# EAGLE design LM (EAGLE 9.6.2)
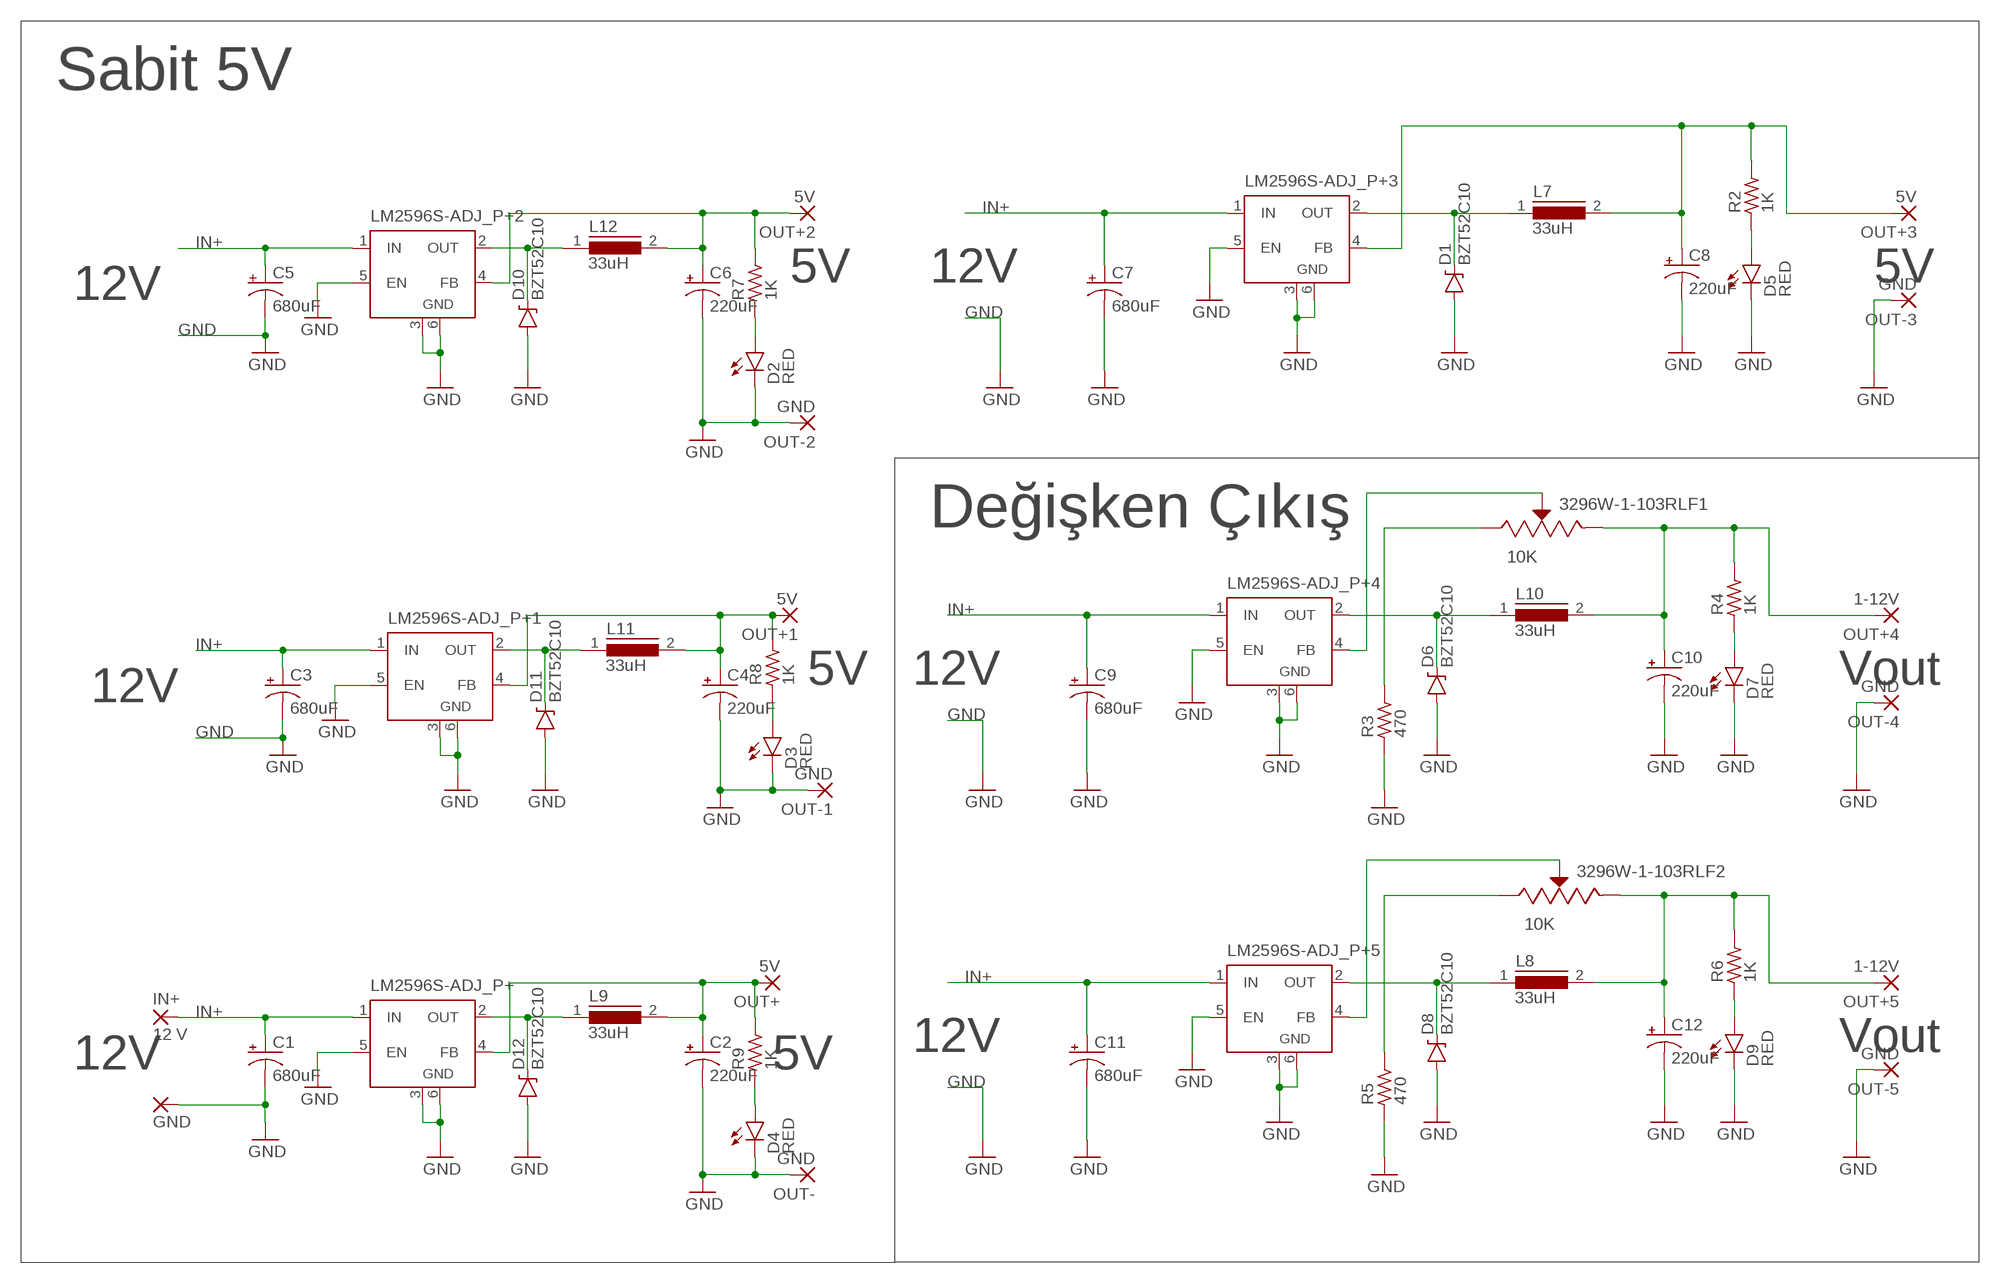
[diagram p0: schematic, sheet 1]

## Parts
3296W-1-103RLF1  10K  3296W-1-103RLF  [TRIM_3296W-1-103RLF]
3296W-1-103RLF2  10K  3296W-1-103RLF  [TRIM_3296W-1-103RLF]
C1  680uF  CAP_POLG  [PANASONIC_G]
C2  220uF  CAP_POLG  [PANASONIC_G]
C3  680uF  CAP_POLG  [PANASONIC_G]
C4  220uF  CAP_POLG  [PANASONIC_G]
C5  680uF  CAP_POLG  [PANASONIC_G]
C6  220uF  CAP_POLG  [PANASONIC_G]
C7  680uF  CAP_POLG  [PANASONIC_G]
C8  220uF  CAP_POLG  [PANASONIC_G]
C9  680uF  CAP_POLG  [PANASONIC_G]
C10  220uF  CAP_POLG  [PANASONIC_G]
C11  680uF  CAP_POLG  [PANASONIC_G]
C12  220uF  CAP_POLG  [PANASONIC_G]
D1  BZT52C10  [SOD-123_2]
D2  RED  LED-RED1206  [LED-1206]
D3  RED  LED-RED1206  [LED-1206]
D4  RED  LED-RED1206  [LED-1206]
D5  RED  LED-RED1206  [LED-1206]
D6  BZT52C10  [SOD-123_2]
D7  RED  LED-RED1206  [LED-1206]
D8  BZT52C10  [SOD-123_2]
D9  RED  LED-RED1206  [LED-1206]
D10  BZT52C10  [SOD-123_2]
D11  BZT52C10  [SOD-123_2]
D12  BZT52C10  [SOD-123_2]
IN+  12 V  SMD5  [SMD2,54-5,08]
IN-  GND  3,81/1,1  [3,81/1,1]
L7  33uH  DR127  [DR127]
L8  33uH  DR127  [DR127]
L9  33uH  DR127  [DR127]
L10  33uH  DR127  [DR127]
L11  33uH  DR127  [DR127]
L12  33uH  DR127  [DR127]
LM2596S-ADJ_P+  LM2596S  [TO263-5]
LM2596S-ADJ_P+1  LM2596S  [TO263-5]
LM2596S-ADJ_P+2  LM2596S  [TO263-5]
LM2596S-ADJ_P+3  LM2596S  [TO263-5]
LM2596S-ADJ_P+4  LM2596S  [TO263-5]
LM2596S-ADJ_P+5  LM2596S  [TO263-5]
OUT+  5V  SMD5  [SMD2,54-5,08]
OUT+1  5V  SMD5  [SMD2,54-5,08]
OUT+2  5V  SMD5  [SMD2,54-5,08]
OUT+3  5V  SMD5  [SMD2,54-5,08]
OUT+4  1-12V  SMD5  [SMD2,54-5,08]
OUT+5  1-12V  SMD5  [SMD2,54-5,08]
OUT-  GND  3,81/1,1  [3,81/1,1]
OUT-1  GND  3,81/1,1  [3,81/1,1]
OUT-2  GND  3,81/1,1  [3,81/1,1]
OUT-3  GND  3,81/1,1  [3,81/1,1]
OUT-4  GND  3,81/1,1  [3,81/1,1]
OUT-5  GND  3,81/1,1  [3,81/1,1]
R2  1K  R_0805  [R0805]
R3  470  R_1206  [R1206]
R4  1K  R_0805  [R0805]
R5  470  R_1206  [R1206]
R6  1K  R_0805  [R0805]
R7  1K  R_0805  [R0805]
R8  1K  R_0805  [R0805]
R9  1K  R_0805  [R0805]

## Nets
GND: C1.- C2.- C3.- C4.- C5.- C6.- C7.- C8.- C9.- C10.- C11.- C12.- D1.A D2.C D3.C D4.C D5.C D6.A D7.C D8.A D9.C D10.A D11.A D12.A IN-.1(P) LM2596S-ADJ_P+1.3(GND) LM2596S-ADJ_P+1.5(EN) LM2596S-ADJ_P+1.6(GND) LM2596S-ADJ_P+2.3(GND) LM2596S-ADJ_P+2.5(EN) LM2596S-ADJ_P+2.6(GND) LM2596S-ADJ_P+3.3(GND) LM2596S-ADJ_P+3.5(EN) LM2596S-ADJ_P+3.6(GND) LM2596S-ADJ_P+4.3(GND) LM2596S-ADJ_P+4.5(EN) LM2596S-ADJ_P+4.6(GND) LM2596S-ADJ_P+5.3(GND) LM2596S-ADJ_P+5.5(EN) LM2596S-ADJ_P+5.6(GND) LM2596S-ADJ_P+.3(GND) LM2596S-ADJ_P+.5(EN) LM2596S-ADJ_P+.6(GND) OUT-1.1(P) OUT-2.1(P) OUT-3.1(P) OUT-4.1(P) OUT-5.1(P) OUT-.1(P) R3.1 R5.1
IN+: C1.+ C3.+ C5.+ C7.+ C9.+ C11.+ IN+.1(P) LM2596S-ADJ_P+1.1(IN) LM2596S-ADJ_P+2.1(IN) LM2596S-ADJ_P+3.1(IN) LM2596S-ADJ_P+4.1(IN) LM2596S-ADJ_P+5.1(IN) LM2596S-ADJ_P+.1(IN)
N$1: D4.A R9.1
N$2: D12.C L9.1 LM2596S-ADJ_P+.2(OUT)
N$3: C2.+ L9.2 LM2596S-ADJ_P+.4(FB) OUT+.1(P) R9.2
N$4: D3.A R8.1
N$5: D11.C L11.1 LM2596S-ADJ_P+1.2(OUT)
N$6: C4.+ L11.2 LM2596S-ADJ_P+1.4(FB) OUT+1.1(P) R8.2
N$7: D2.A R7.1
N$8: D10.C L12.1 LM2596S-ADJ_P+2.2(OUT)
N$9: C6.+ L12.2 LM2596S-ADJ_P+2.4(FB) OUT+2.1(P) R7.2
N$12: D1.C L7.1 LM2596S-ADJ_P+3.2(OUT)
N$13: C8.+ L7.2 LM2596S-ADJ_P+3.4(FB) OUT+3.1(P) R2.2
N$15: D5.A R2.1
N$17: D6.C L10.1 LM2596S-ADJ_P+4.2(OUT)
N$18: 3296W-1-103RLF1.3(CW) C10.+ L10.2 OUT+4.1(P) R4.2
N$19: 3296W-1-103RLF1.1(CCW) R3.2
N$20: D7.A R4.1
N$22: D8.C L8.1 LM2596S-ADJ_P+5.2(OUT)
N$23: 3296W-1-103RLF2.3(CW) C12.+ L8.2 OUT+5.1(P) R6.2
N$24: 3296W-1-103RLF2.1(CCW) R5.2
N$25: D9.A R6.1
N$62: 3296W-1-103RLF1.2(WIPER) LM2596S-ADJ_P+4.4(FB)
N$63: 3296W-1-103RLF2.2(WIPER) LM2596S-ADJ_P+5.4(FB)

## Notes on the sheet
- Sabit 5V
- 5V | 12V | 5V
- 12V
- Değişken Çıkış
- 5V | 12V | Vout
- 12V
- 12V | Vout
- 12V | 5V

## Library data of the parts
3296W-1-103RLF1 3296W-1-103RLF2 = 3296W-1-103RLF:3296W-1-103RLF: Res Cermet Trimmer 500K Ohm 10% 0.5W 25(Elec)Turn 2.19mm (9.53 X 4.83 X 11.55mm) Pin Thru-Hole Tube Check prices <https://pricing.snapeda.com/parts/3296W-1-103RLF/Bourns/view-part?ref=eda>; AVAILABILITY: In Stock; DESCRIPTION: 10 kOhms 0.5W, 1/2W PC Pins Through Hole Trimmer Potentiometer Cermet 25 Turn Top Adjustment; MF: Bourns; MP: 3296W-1-103RLF; PACKAGE: SOT-23-5 Bourns; PRICE: None; PURCHASE-URL: https://pricing.snapeda.com/search/part/3296W-1-103RLF/?ref=eda
C1-C12 = asl_cap:CAP_POL: Capacitor Polarized These are standard SMD and PTH capacitors. Normally 10uF, 47uF, and 100uF in electrolytic and tantalum varieties. Always verify the external diameter of the through hole cap, it varies with capacity, voltage, and manufacturer. The EIA devices should be standard.
D1 D6 D8 D10-D12 = BZT52C10:BZT52C10: Zener 10V 500mW Check prices <https://pricing.snapeda.com/parts/BZT52C10/Diotec%20Semiconductor/view-part?ref=eda>; AVAILABILITY: In Stock; DESCRIPTION: Diode Zener Single 10V 5% 500mW Automotive 2-Pin SOD-123 T/R; MF: Diotec Semiconductor; MP: BZT52C10; PACKAGE: SOD-123 Diotec Semiconductor; PRICE: None; PURCHASE-URL: https://pricing.snapeda.com/search/part/BZT52C10/?ref=eda
D2-D5 D7 D9 = SparkFun-LED:LED-RED: Assorted Red LEDs LilyPad 1206- DIO-09912 1206- DIO-00809 0603- DIO-00819 "SMART" means more efficient and expensive; PROD_ID: DIO-09912
IN+ OUT+ OUT+1-OUT+5 = wirepad:SMD5: SMD PAD
IN- OUT- OUT-1-OUT-5 = wirepad:3,81/1,1: THROUGH-HOLE PAD
L7-L12 = inductors:DR127: High Power Density, High Efficiency, Shielded Inductors Source: coiltronics_dr_series.pdf; SPICEPREFIX: L
LM2596S-ADJ_P+ LM2596S-ADJ_P+1-LM2596S-ADJ_P+5 = linear:LM2596S: STEP-DOWN VOLTAGE REGULATOR
R2-R9 = cap_master-smd:R_: RESISTOR

## Board
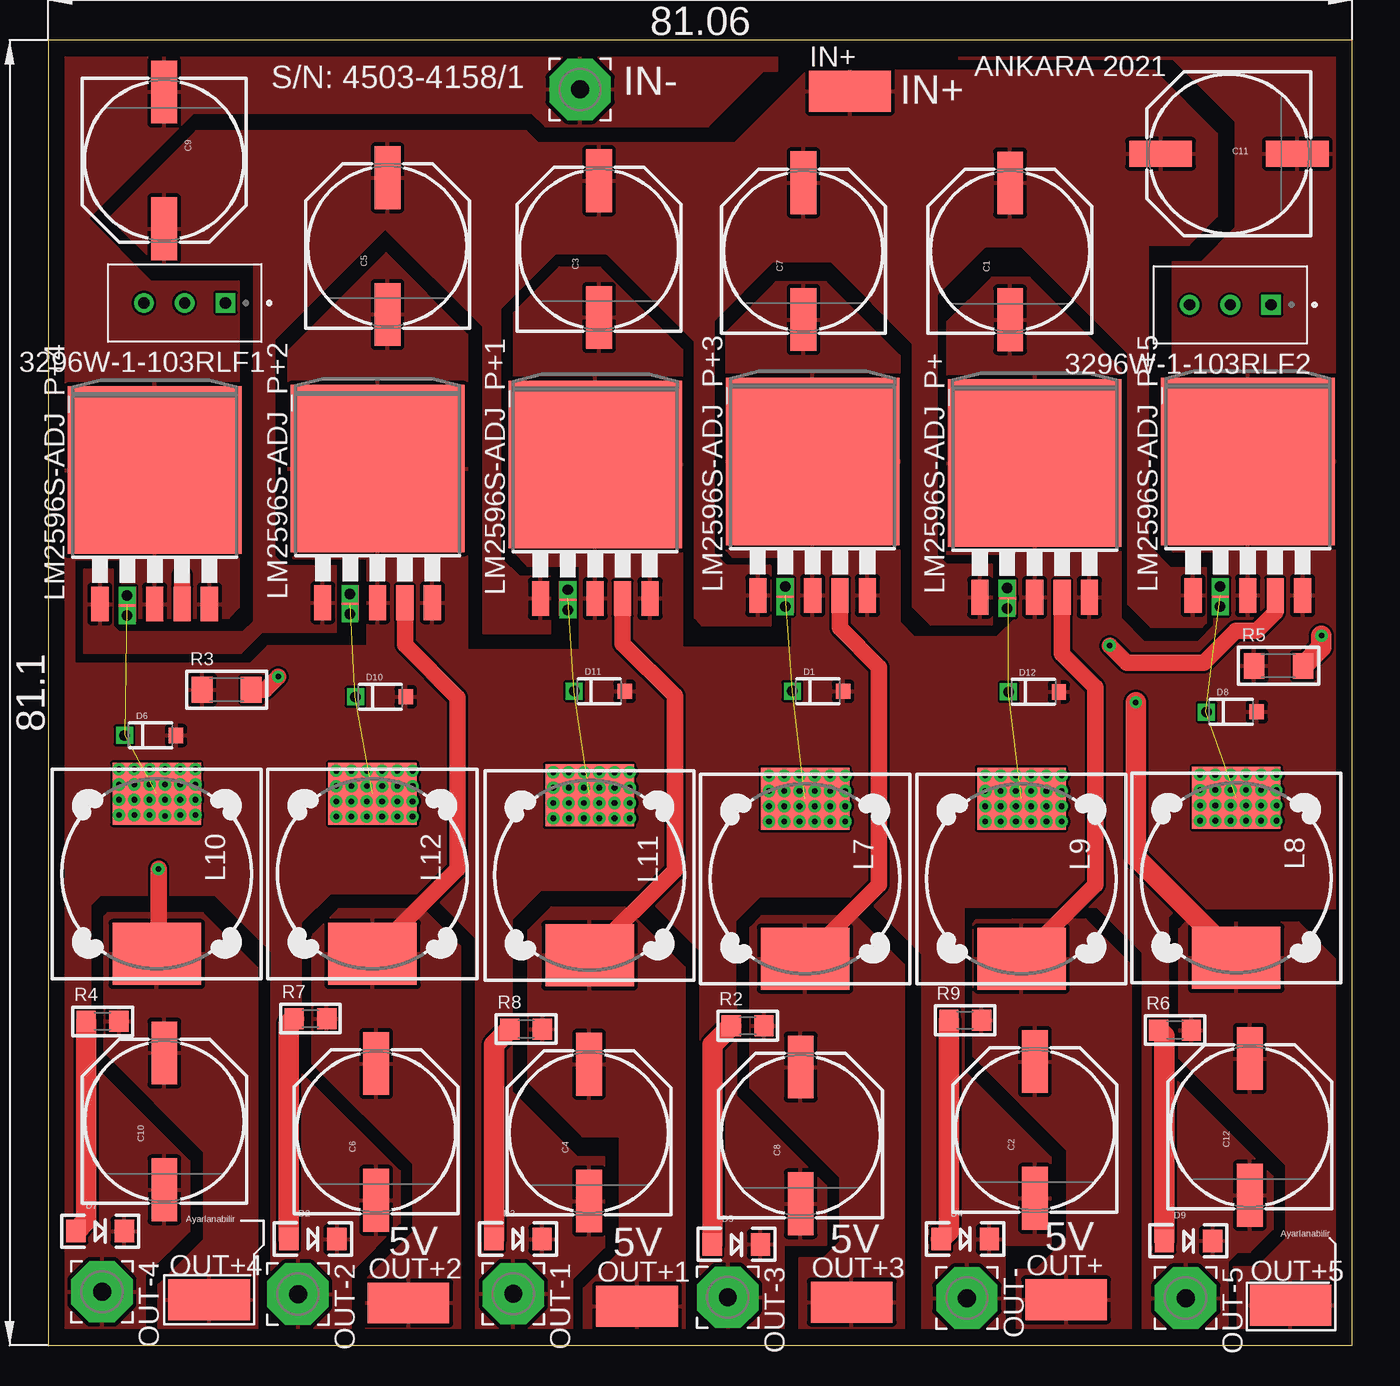
[diagram p1: board, top side]
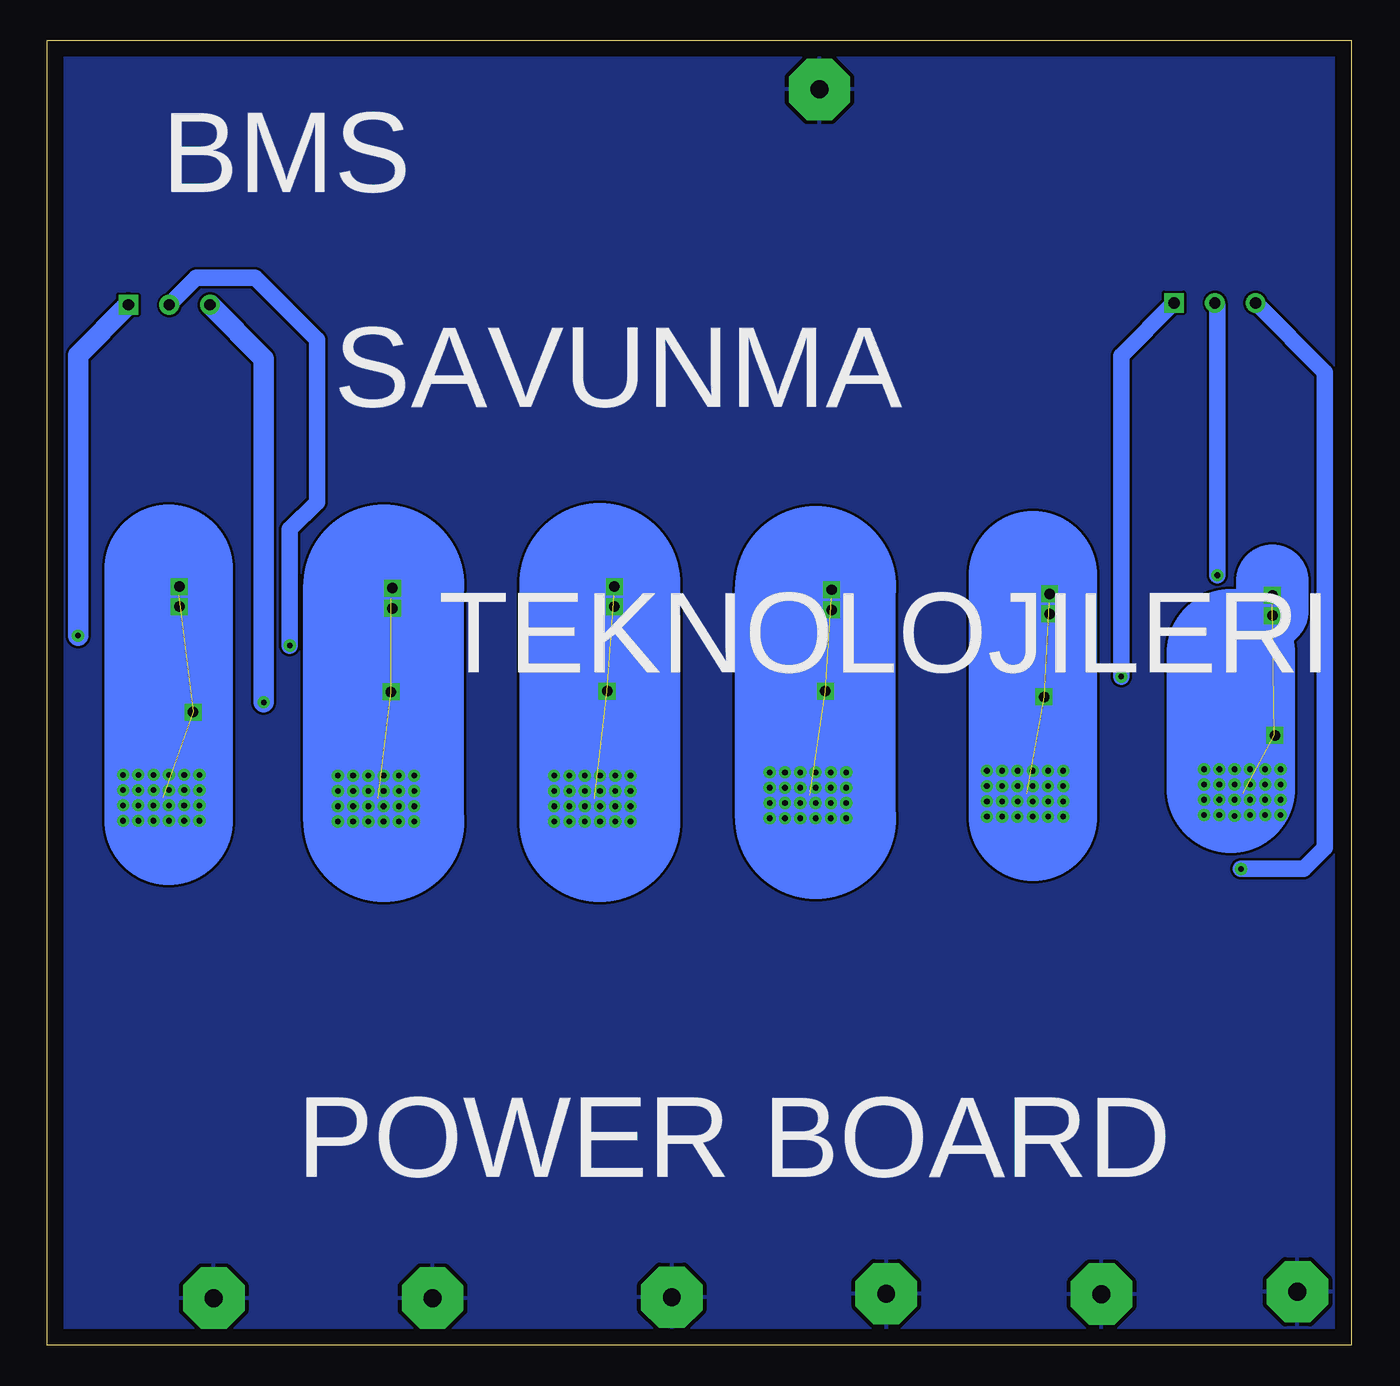
[diagram p2: board, bottom side, seen from below]

Size 81.06 x 81.1 mm. Coordinates in mm from the lower left corner, seen from the top.
Outline: 0,81.1 0,0 81.06,0 81.06,81.1 0,81.1
Copper layers (1*16): Top 0.035mm / dielectric 1.5mm / Bottom 0.035mm
Design rules "default": minimum track width 6mil, minimum drill 0.35mm, track to track 6mil, track to pad 6mil, pad to pad 6mil, via to via 6mil, smd to smd 6mil, copper to edge 40mil, drill to drill 6mil, minimum pad ring 10mil, minimum via ring 8mil, stop-mask expansion 4mil, vias tented up to drill 0mil, thermal gap 10mil

### Footprints (pad centres in the part's own frame; a part is rotated, then mirrored left to right if it is on the bottom)
TRIM_3296W-1-103RLF = drill 0.71 square: 1 -2.54,0 | drill 0.71: 2 0,0; 3 2.54,0
PANASONIC_G = smd 3.9 x 1.6: + 4.25,0; - -4.25,0
SOD-123_2 = smd 0.9 x 0.95: A 1.575,0; C -1.575,0
LED-1206 = smd 1.2 x 1.4: A -1.5,0; C 1.5,0
SMD2,54-5,08 = smd 2.54 x 5.08: 1 0,0
3,81/1,1 = drill 1.118 pad 3.81 octagon: 1 0,0
DR127 = smd 3.85 x 5.5: 1 -4.975,0; 2 4.975,0
TO263-5 = smd 1.067 x 2.159: 1 -3.404,-5.791; 2 -1.702,-5.791; 3 0,-5.791; 4 1.702,-5.791; 5 3.404,-5.791 | smd 10.8 x 10.41: 6 0,2.54
R0805 = smd 1.2 x 1.3: 1 -1.016,0; 2 1.016,0
R1206 = smd 1.3 x 1.6: 1 -1.524,0; 2 1.524,0

### Placement (x,y rotation side)
3296W-1-103RLF1  8.48,64.78 180 top
3296W-1-103RLF2  73.48,64.66 180 top
C1  59.79,67.98 90 top
C2  61.33,13.38 90 top
C3  34.24,68.12 90 top
C4  33.61,13.21 90 top
C5  21.09,68.31 90 top
C6  20.38,13.26 90 top
C7  46.94,67.99 90 top
C8  46.77,13.04 90 top
C9  7.21,73.64 270 top
C10  7.22,13.92 90 top
C11  73.4,74.04 180 top
C12  74.7,13.57 90 top
D1  47.84,40.64 0 top
D2  16.45,6.6 0 top
D3  29.2,6.6 0 top
D4  57,6.6 0 top
D5  42.78,6.27 0 top
D6  6.37,37.9 0 top
D7  3.23,7.09 0 top
D8  73.54,39.38 0 top
D9  70.88,6.49 0 top
D10  20.65,40.3 0 top
D11  34.25,40.65 0 top
D12  61.25,40.6 0 top
IN+  49.83,77.94 270 top
IN-  33.06,78.04 270 top
L7  47.05,29 270 top
L8  73.85,29.05 270 top
L9  60.5,29 270 top
L10  6.75,29.3 270 top
L11  33.65,29.2 270 top
L12  20.15,29.3 270 top
LM2596S-ADJ_P+  61.32,52.28 0 top
LM2596S-ADJ_P+1  34,52.2 0 top
LM2596S-ADJ_P+2  20.47,51.94 0 top
LM2596S-ADJ_P+3  47.52,52.39 0 top
LM2596S-ADJ_P+4  6.62,51.85 0 top
LM2596S-ADJ_P+5  74.57,52.39 0 top
OUT+  63.28,2.83 270 top
OUT+1  36.6,2.43 270 top
OUT+2  22.39,2.63 270 top
OUT+3  49.94,2.68 270 top
OUT+4  10.01,2.83 270 top
OUT+5  77.22,2.48 270 top
OUT-  57.11,2.93 270 top
OUT-1  28.91,3.2 270 top
OUT-2  15.52,3.18 270 top
OUT-3  42.24,2.98 270 top
OUT-4  3.34,3.33 270 top
OUT-5  70.71,2.93 270 top
R2  43.48,19.86 0 top
R3  11.1,40.73 0 top
R4  3.38,20.13 0 top
R5  76.48,42.22 0 top
R6  70.04,19.59 0 top
R7  16.3,20.3 0 top
R8  29.7,19.65 0 top
R9  57,20.2 0 top

### Tracks (layer width: path | path; a pad name or v marks a point on that pad's centre or on a via)
GND
  pour Top: 6,1.2 6,4.35 8.75,7.1 8.75,11.45 2.6,17.6 2.6,27.35 3.25,28 10.35,28 13.9,24.45 13.9,0 18.8,0 18.8,4.55 21.85,7.6 21.85,10.8 15.7,16.95 15.7,26.25 17.55,28.1 23.8,28.1 26.6,25.3 26.6,0.05 32.55,0.05 32.55,4.1 34.55,6.1 34.55,11.7 32.9,11.7 28.8,15.8 28.8,26.45 30.65,28.3 36.75,28.3 40.55,24.5 40.55,0.1 45.7,0.1 45.7,6.25 48.35,6.25 48.35,9.9 42.75,15.5 42.75,21.1 42.7,21.15 42.7,26.35 44.25,27.9 50.75,27.9 54.35,24.3 54.35,0 59.45,0 59.45,6.25 62.3,6.25 62.3,11.7 56.9,17.1 56.9,27.25 65.2,27.25 68.05,24.4 68.05,0 73.3,0 73.3,5.15 73.95,5.8 74.7,5.8 76.1,7.2 76.1,10.5 69.6,17 69.6,26.6 70.15,27.15 81.05,27.15 81.05,81.1 56.8,81.1 56.65,80.95 56.65,79.95 69.92,79.95 73.83,76.03 73.83,69.47 71.68,67.31 69.9,67.31 69.9,49.35 72.5,49.35 72.5,44.75 71.45,43.7 68.15,43.7 66.65,45.2 66.65,60.7 61,66.35 58.65,66.35 55.9,63.6 55.9,49.2 60.2,49.2 60.2,45.25 58.95,44 53.85,44 52.9,44.95 52.9,61.5 48.35,66.05 45.25,66.05 42.15,62.95 42.15,49.4 42.55,49 46.25,49 46.25,43.35 39.4,43.35 39.4,61.85 34.3,66.95 31.75,66.95 28.95,64.15 28.95,49.3 29.8,48.45 33.05,48.45 33.05,43.2 26.05,43.2 26.05,62.8 21,67.85 14.95,61.8 14.95,49.2 15.25,48.9 19.85,48.9 19.85,43.45 13.65,43.45 12.55,42.35 1.6,42.35 1.6,48.85 4.6,48.85 4.6,45.2 11.2,45.2 11.85,45.85 11.85,66.1 6.4,66.1 2.48,70.03 9.05,76.6 30.05,76.6 30.9,75.75 41,75.75 44.45,79.2 45.3,79.2 45.3,81 45.25,81.05 0,81.05 0,0 6.05,0 6.05,1.15
  pour Bottom: -1.4,82 -1.4,-1.3 81.55,-1.3 81.55,82
IN+
  pour Top: 47.15,79.2 68.75,79.2 72.65,75.3 72.65,70.15 70.9,68.4 68.35,68.4 68.35,49.75 69.8,48.3 71.95,48.3 71.95,44.9 71.7,44.65 68.55,44.65 67.15,46.05 67.15,61.65 60.5,68.3 58.25,68.3 55.2,65.25 55.2,49.15 55.85,48.5 58.65,48.5 58.65,44.8 54.85,44.8 53.75,45.9 53.75,62.25 48.65,67.35 45.05,67.35 41.35,63.65 41.35,49.25 42.15,48.45 44.85,48.45 44.9,48.4 44.9,44.75 40.65,44.75 40.2,45.2 40.2,62.35 34.7,67.85 31.55,67.85 28.1,64.4 28.1,48.95 29.3,47.75 31.2,47.75 31.2,44.25 27.05,44.25 27.05,63.3 20.95,69.4 14.05,62.5 14.05,49.05 14.7,48.4 17.85,48.4 17.85,44.35 13.3,44.35 12,43.05 2.25,43.05 2.25,48.2 4,48.2 4,44.7 4.4,44.3 12.1,44.3 12.8,45 12.8,67.2 6.7,67.2 3.83,70.08 9.2,75.45 29.7,75.45 30.45,74.7 42.65,74.7
N$1
  Top 1.27: R9.1 55.98,7.08 D4.A
N$2  (2 unrouted)
  Top 1.016: 59.67,46.43 LM2596S-ADJ_P+.2
N$3
  Top 1.016: LM2596S-ADJ_P+.4 63.02,42.98 65.1,40.9 65.1,28.62 L9.2
  pour Top: 59.9,26.4 57.7,26.4 57.5,26.2 57.5,17.95 63.35,12.1 63.35,6.65 61.4,4.7 60.2,4.7 60.2,0.9 67.3,0.9 67.3,23.65 64.5,26.45 59.95,26.45
N$4
  Top 1.27: R8.1 27.7,18.67 D3.A
N$5  (2 unrouted)
N$6
  Top 1.016: LM2596S-ADJ_P+1.4 35.7,43.6 38.95,40.35 38.95,29.52 L11.2
  pour Top: 31.25,27.2 29.85,25.8 29.85,16.35 33.2,13 35.55,13 35.55,5.8 33.3,3.55 33.3,0.35 39.55,0.35 39.55,23.5 35.85,27.2
N$7
  Top 1.27: R7.1 14.95,19.97 D2.A
N$8  (2 unrouted)
N$9
  Top 1.016: LM2596S-ADJ_P+2.4 22.17,43.53 25.45,40.25 25.45,29.62 L12.2
  pour Top: 18.05,27.1 16.5,25.55 16.5,25.45 16.45,25.4 16.45,17.5 22.7,11.25 22.7,7.05 19.75,4.1 19.75,0.2 25.6,0.2 25.6,24.8 23.3,27.1
N$10  (via drill 0.65)
  Bottom 4.5: 4.9,47.5 v4.9,46.6 4.9,45.6 7.5,43
  Bottom 8: 7.5,43 7.5,34.6
N$11  (via drill 0.65)
  other vias: 4.9,45.35
N$12  (2 unrouted)
N$13
  Top 1.016: LM2596S-ADJ_P+3.4 49.22,44.58 51.65,42.15 51.65,28.62 L7.2
  pour Top: 50.2,26.65 44.35,26.65 43.65,25.95 43.65,16 49.25,10.4 49.25,6.45 48.2,5.4 46.7,5.4 46.7,0.35 53.2,0.35 53.2,23.65
N$14  (via drill 0.65)
  other vias: 4.75,37.9
N$15
  Top 1.27: R2.1 41.28,18.68 D5.A
N$16  (via drill 0.65)
  other vias: 18.75,46.7
N$17  (2 unrouted)
N$18  (via drill 0.35)
  Top 1.016: v6.85,29.6 6.85,24.43 L10.2
  Bottom 1.016: v6.85,29.6 2.95,29.6 1.64,30.91 1.64,60.48 3296W-1-103RLF1.3
  pour Top: 3.5,26.65 3.5,18.2 9.7,12 9.7,6.6 6.85,3.75 6.85,0.35 13,0.35 13,23.45 9.6,26.85 3.7,26.85
N$19  (via drill 0.35)
  Top 1.016: v14.3,41.55 13.48,40.73 R3.2
  Bottom 1.016: 3296W-1-103RLF1.1 14.3,61.5 v14.3,41.55
N$20
  Top 1.27: R4.1 2.36,7.72 D7.A
N$21  (via drill 0.35)
  other vias: 4.4,35.8
N$22  (2 unrouted)
N$23  (via drill 0.35)
  Top 1.27: L8.2 67.6,30.32 v67.6,39.95
  Bottom 1.27: v67.6,39.95 67.6,61.32 3296W-1-103RLF2.3
  pour Top: 77.75,26.25 70.7,26.25 70.3,25.85 70.3,17.85 76.95,11.2 76.95,6.65 75.15,4.85 73.7,4.85 73.95,4.6 73.95,0.5 80.55,0.5 80.55,23.45
N$24  (via drill 0.35)
  Top 1.27: R5.2 79.15,43.37 v79.15,44.1
  Bottom 1.27: v79.15,44.1 79.15,61.53 3296W-1-103RLF2.1
N$25
  Top 1.27: R6.1 69.38,19.23 D9.A
N$26  (via drill 0.35)
  other vias: 5.35,35.8
N$27  (via drill 0.35)
  other vias: 6.3,35.8
N$28  (via drill 0.35)
  other vias: 7.25,35.8
N$29  (via drill 0.65)
  other vias: 18.75,45.45
N$30  (via drill 0.35)
  other vias: 9.15,35.8
N$31  (via drill 0.35)
  other vias: 4.4,34.85
N$32  (via drill 0.35)
  other vias: 5.35,34.85
N$33  (via drill 0.35)
  other vias: 6.3,34.85
N$34  (via drill 0.35)
  other vias: 7.25,34.85
N$35  (via drill 0.35)
  other vias: 8.2,34.85
N$36  (via drill 0.35)
  other vias: 9.15,34.85
N$37  (via drill 0.35)
  other vias: 4.4,33.9
N$38  (via drill 0.35)
  other vias: 5.35,33.9
N$39  (via drill 0.35)
  other vias: 6.3,33.9
N$40  (via drill 0.35)
  other vias: 7.25,33.9
N$41  (via drill 0.35)
  other vias: 8.2,33.9
N$42  (via drill 0.35)
  other vias: 9.15,33.9
N$43  (via drill 0.35)
  other vias: 4.4,32.95
N$44  (via drill 0.35)
  other vias: 5.35,32.95
N$45  (via drill 0.35)
  other vias: 6.3,32.95
N$46  (via drill 0.35)
  other vias: 7.25,32.9
N$47  (via drill 0.35)
  other vias: 8.2,32.95
N$48  (via drill 0.35)
  other vias: 9.15,32.95
N$49  (via drill 0.65)
  other vias: 19.1,40.3
N$50  (via drill 0.65)
  other vias: 32.3,46.95
N$51  (via drill 0.65)
  other vias: 32.3,45.7
N$52  (via drill 0.65)
  other vias: 32.7,40.65
N$53  (via drill 0.65)
  other vias: 46.25,40.65
N$54  (via drill 0.65)
  other vias: 45.8,47.15
N$55  (via drill 0.65)
  other vias: 45.8,45.9
N$56  (via drill 0.65)
  other vias: 59.6,47.05
N$57  (via drill 0.65)
  other vias: 59.6,45.8
N$58  (via drill 0.65)
  other vias: 59.7,40.6
N$59  (via drill 0.65)
  other vias: 72,39.35
N$60  (via drill 0.65)
  other vias: 72.85,47.15
N$61  (via drill 0.65)
  other vias: 72.85,45.9
N$62  (via drill 0.35)
  Top 1.016: LM2596S-ADJ_P+4.4 v8.32,47.85
  Bottom 1.016: v8.32,47.85 8.32,64.62 3296W-1-103RLF1.2
N$63  (via drill 0.35)
  Top 1.016: LM2596S-ADJ_P+5.4 76.27,45.56 75.13,44.41 73.82,44.41 71.83,42.42 67.05,42.42 v65.98,43.48
  Bottom 1.016: v65.98,43.48 65.98,50.7 64.3,52.39 64.3,62.5 68.13,66.33 71.82,66.33 73.48,64.67 3296W-1-103RLF2.2
N$69  (via drill 0.35)
  other vias: 17.9,35.7
N$70  (via drill 0.35)
  other vias: 18.85,35.7
N$71  (via drill 0.35)
  other vias: 19.8,35.7
N$72  (via drill 0.35)
  other vias: 20.75,35.7
N$73  (via drill 0.35)
  other vias: 21.7,35.7
N$74  (via drill 0.35)
  other vias: 22.65,35.7
N$75  (via drill 0.35)
  other vias: 17.9,34.75
N$76  (via drill 0.35)
  other vias: 18.85,34.75
N$77  (via drill 0.35)
  other vias: 19.8,34.75
N$78  (via drill 0.35)
  other vias: 20.75,34.75
N$79  (via drill 0.35)
  other vias: 21.7,34.75
N$80  (via drill 0.35)
  other vias: 22.65,34.75
N$81  (via drill 0.35)
  other vias: 17.9,33.8
N$82  (via drill 0.35)
  other vias: 18.85,33.8
N$83  (via drill 0.35)
  other vias: 19.8,33.8
N$84  (via drill 0.35)
  other vias: 20.75,33.8
N$85  (via drill 0.35)
  other vias: 21.7,33.8
N$86  (via drill 0.35)
  other vias: 22.65,33.8
N$87  (via drill 0.35)
  other vias: 17.9,32.85
N$88  (via drill 0.35)
  other vias: 18.85,32.85
N$89  (via drill 0.35)
  Bottom 8: v19.8,32.85 19.8,47.85
N$90  (via drill 0.35)
  other vias: 20.75,32.85
N$91  (via drill 0.35)
  other vias: 21.7,32.85
N$92  (via drill 0.35)
  other vias: 22.65,32.85
N$93  (via drill 0.35)
  other vias: 31.4,35.6
N$94  (via drill 0.35)
  other vias: 32.35,35.6
N$95  (via drill 0.35)
  other vias: 33.3,35.6
N$96  (via drill 0.35)
  other vias: 34.25,35.6
N$97  (via drill 0.35)
  other vias: 35.2,35.6
N$98  (via drill 0.35)
  other vias: 36.15,35.6
N$99  (via drill 0.35)
  other vias: 31.4,34.65
N$100  (via drill 0.35)
  other vias: 32.35,34.65
N$101  (via drill 0.35)
  other vias: 33.3,34.65
N$102  (via drill 0.35)
  other vias: 34.25,34.65
N$103  (via drill 0.35)
  other vias: 35.2,34.65
N$104  (via drill 0.35)
  other vias: 36.15,34.65
N$105  (via drill 0.35)
  other vias: 31.4,33.7
N$106  (via drill 0.35)
  other vias: 32.35,33.7
N$107  (via drill 0.35)
  other vias: 33.3,33.7
N$108  (via drill 0.35)
  other vias: 34.25,33.7
N$109  (via drill 0.35)
  other vias: 35.2,33.7
N$110  (via drill 0.35)
  other vias: 36.15,33.7
N$111  (via drill 0.35)
  other vias: 31.4,32.75
N$112  (via drill 0.35)
  other vias: 32.35,32.75
N$113  (via drill 0.35)
  Bottom 10: v33.3,32.75 33.3,47.15
N$114  (via drill 0.35)
  other vias: 34.25,32.75
N$115  (via drill 0.35)
  other vias: 35.2,32.75
N$116  (via drill 0.35)
  other vias: 36.15,32.75
N$117  (via drill 0.35)
  other vias: 44.8,35.4
N$118  (via drill 0.35)
  other vias: 45.75,35.4
N$119  (via drill 0.35)
  other vias: 46.7,35.4
N$120  (via drill 0.35)
  other vias: 47.65,35.4
N$121  (via drill 0.35)
  other vias: 48.6,35.4
N$122  (via drill 0.35)
  other vias: 49.55,35.4
N$123  (via drill 0.35)
  other vias: 44.8,34.45
N$124  (via drill 0.35)
  other vias: 45.75,34.45
N$125  (via drill 0.35)
  other vias: 46.7,34.45
N$126  (via drill 0.35)
  other vias: 47.65,34.45
N$127  (via drill 0.35)
  other vias: 48.6,34.45
N$128  (via drill 0.35)
  other vias: 49.55,34.45
N$129  (via drill 0.35)
  other vias: 44.8,33.5
N$130  (via drill 0.35)
  other vias: 45.75,33.5
N$131  (via drill 0.35)
  other vias: 46.7,33.5
N$132  (via drill 0.35)
  other vias: 47.65,33.5
N$133  (via drill 0.35)
  other vias: 48.6,33.5
N$134  (via drill 0.35)
  other vias: 49.55,33.5
N$135  (via drill 0.35)
  other vias: 44.8,32.55
N$136  (via drill 0.35)
  other vias: 45.75,32.55
N$137  (via drill 0.35)
  Bottom 10: v46.7,32.55 46.7,47.35
N$138  (via drill 0.35)
  other vias: 47.65,32.55
N$139  (via drill 0.35)
  other vias: 48.6,32.55
N$140  (via drill 0.35)
  other vias: 49.55,32.55
N$141  (via drill 0.35)
  other vias: 58.25,35.4
N$142  (via drill 0.35)
  other vias: 59.2,35.4
N$143  (via drill 0.35)
  other vias: 60.15,35.4
N$144  (via drill 0.35)
  other vias: 61.1,35.4
N$145  (via drill 0.35)
  other vias: 62.05,35.4
N$146  (via drill 0.35)
  other vias: 63,35.4
N$147  (via drill 0.35)
  other vias: 58.25,34.45
N$148  (via drill 0.35)
  other vias: 59.2,34.45
N$149  (via drill 0.35)
  other vias: 60.15,34.45
N$150  (via drill 0.35)
  other vias: 61.1,34.45
N$151  (via drill 0.35)
  other vias: 62.05,34.45
N$152  (via drill 0.35)
  other vias: 63,34.45
N$153  (via drill 0.35)
  other vias: 58.25,33.5
N$154  (via drill 0.35)
  other vias: 59.2,33.5
N$155  (via drill 0.35)
  other vias: 60.15,33.5
N$156  (via drill 0.35)
  other vias: 61.1,33.5
N$157  (via drill 0.35)
  other vias: 62.05,33.5
N$158  (via drill 0.35)
  other vias: 63,33.5
N$159  (via drill 0.35)
  other vias: 58.25,32.55
N$160  (via drill 0.35)
  other vias: 59.2,32.55
N$161  (via drill 0.35)
  Bottom 10: v60.15,32.55 60.15,47.25
N$162  (via drill 0.35)
  other vias: 61.1,32.55
N$163  (via drill 0.35)
  other vias: 62.05,32.55
N$164  (via drill 0.35)
  other vias: 63,32.55
N$165  (via drill 0.35)
  other vias: 71.6,35.45
N$166  (via drill 0.35)
  other vias: 72.55,35.45
N$167  (via drill 0.35)
  other vias: 73.5,35.45
N$168  (via drill 0.35)
  other vias: 74.45,35.45
N$169  (via drill 0.35)
  other vias: 75.4,35.45
N$170  (via drill 0.35)
  other vias: 76.35,35.45
N$171  (via drill 0.35)
  other vias: 71.6,34.5
N$172  (via drill 0.35)
  other vias: 72.55,34.5
N$173  (via drill 0.35)
  other vias: 73.5,34.5
N$174  (via drill 0.35)
  other vias: 74.45,34.5
N$175  (via drill 0.35)
  other vias: 75.4,34.5
N$176  (via drill 0.35)
  other vias: 76.35,34.5
N$177  (via drill 0.35)
  other vias: 71.6,33.55
N$178  (via drill 0.35)
  other vias: 72.55,33.55
N$179  (via drill 0.35)
  other vias: 73.5,33.55
N$180  (via drill 0.35)
  other vias: 74.45,33.55
N$181  (via drill 0.35)
  other vias: 75.4,33.55
N$182  (via drill 0.35)
  other vias: 76.35,33.55
N$183  (via drill 0.35)
  other vias: 71.6,32.6
N$184  (via drill 0.35)
  other vias: 72.55,32.6
N$185  (via drill 0.35)
  Bottom 8: v73.5,32.6 73.5,48.25
N$186  (via drill 0.35)
  other vias: 74.45,32.6
N$187  (via drill 0.35)
  other vias: 75.4,32.6
N$188  (via drill 0.35)
  other vias: 76.35,32.6
N$189  (via drill 0.35)
  other vias: 8.2,35.8

### Text on the board
tNames: ANKARA 2021 | S/N: 4503-4158/1 | IN- | IN+ | Ayarlanabilir | Ayarlanabilir | 5V | 5V | 5V | 5V
bNames: BMS | SAVUNMA | TEKNOLOJILERI | POWER BOARD